# Altium schematic sheet ATmega328 V1.0.SchDoc
size 228 x 88 mm
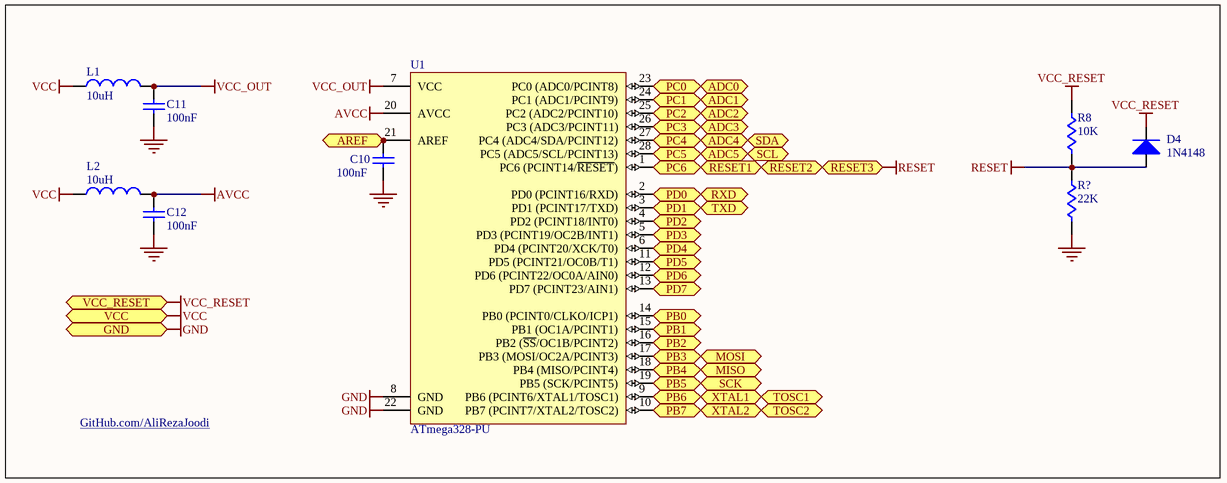
[diagram p0: ATmega328 V1.0.SchDoc]

## Parts
C10  100nF  [CAPNTO2.54-3.56x2.03]
C11  100nF  [CAPNTO2.54-3.56x2.03]
C12  100nF  [CAPNTO5.08-7.37x3.94]
D4  1N4148  [DIODE0.4_Glass]
L1  10uH  [Inductor_1]
L2  10uH  [Inductor_1]
R8  10K  [AXIAL-0.4]
R?  22K  [AXIAL-0.4]
U1  ATmega328-PU  [28P3]

## Ports
ADC0, ADC1, ADC2, ADC3, ADC4, ADC5, AREF, GND, MISO, MOSI, PB0, PB1, PB2, PB3, PB4, PB5, PB6, PB7, PC0, PC1, PC2, PC3, PC4, PC5, PC6, PD0, PD1, PD2, PD3, PD4, PD5, PD6, PD7, RESET1, RESET2, RESET3, RXD, SCK, SCL, SDA, TOSC1, TOSC2, TXD, VCC, VCC_RESET, XTAL1, XTAL2

## Nets
AVCC: C12.2 L2.2 U1.20(AVCC)
GND: C10.1 C11.1 C12.1 R?.1 U1.8(GND) U1.22(GND) ; port GND
RESET: D4.1(A) R8.1 R?.2 U1.1(PC6_(PCINT14/~{RESET})) ; port RESET1, port PC6, port RESET2, port RESET3
VCC: L1.2 L2.1 ; port VCC
VCC_OUT: C11.2 L1.1 U1.7(VCC)
VCC_RESET: D4.2(K) R8.2 ; port VCC_RESET
ADC0: U1.23(PC0_(ADC0/PCINT8)) ; port ADC0, port PC0
ADC1: U1.24(PC1_(ADC1/PCINT9)) ; port PC1, port ADC1
ADC2: U1.25(PC2_(ADC2/PCINT10)) ; port PC2, port ADC2
ADC3: U1.26(PC3_(ADC3/PCINT11)) ; port PC3, port ADC3
ADC4: U1.27(PC4_(ADC4/SDA/PCINT12)) ; port SDA, port PC4, port ADC4
ADC5: U1.28(PC5_(ADC5/SCL/PCINT13)) ; port SCL, port PC5, port ADC5
AREF: C10.2 U1.21(AREF) ; port AREF
MISO: U1.18(PB4_(MISO/PCINT4)) ; port PB4, port MISO
MOSI: U1.17(PB3_(MOSI/OC2A/PCINT3)) ; port PB3, port MOSI
PB0: U1.14(PB0_(PCINT0/CLKO/ICP1)) ; port PB0
PB1: U1.15(PB1_(OC1A/PCINT1)) ; port PB1
PB2: U1.16(PB2_(~{SS}/OC1B/PCINT2)) ; port PB2
PB5: U1.19(PB5_(SCK/PCINT5)) ; port PB5, port SCK
PB6: U1.9(PB6_(PCINT6/XTAL1/TOSC1)) ; port PB6, port XTAL1, port TOSC1
PB7: U1.10(PB7_(PCINT7/XTAL2/TOSC2)) ; port PB7, port XTAL2, port TOSC2
PD0: U1.2(PD0_(PCINT16/RXD)) ; port PD0, port RXD
PD1: U1.3(PD1_(PCINT17/TXD)) ; port PD1, port TXD
PD2: U1.4(PD2_(PCINT18/INT0)) ; port PD2
PD3: U1.5(PD3_(PCINT19/OC2B/INT1)) ; port PD3
PD4: U1.6(PD4_(PCINT20/XCK/T0)) ; port PD4
PD5: U1.11(PD5_(PCINT21/OC0B/T1)) ; port PD5
PD6: U1.12(PD6_(PCINT22/OC0A/AIN0)) ; port PD6
PD7: U1.13(PD7_(PCINT23/AIN1)) ; port PD7

## Notes on the sheet
- GitHub.com/AliRezaJoodi

## Library data of the parts
C10-C12 = Cap: Capacitor; Manufacturer: Generic Components; Class I: Passive; Published: 8-Jun-2000; Revision: July-2002: Re-released for DXP Platform.; Publisher: Altium Limited; Class II: Capacitor
D4 = Diode: Default Diode; Manufacturer: Generic Components; Class I: Discrete; Class II: Diode - Switching; Published: 8-Jun-2000; Revision: July-2002: Re-released for DXP Platform.; Publisher: Altium Limited
L1 L2 = Inductor: Manufacturer: Generic Components; Class I: Passive; Published: 8-Jun-2000; Revision: July-2002: Re-released for DXP Platform.; Publisher: Altium Limited; Class II: Inductor; Supplier 1: Newark
R8 R? = Res1: Resistor; Manufacturer: Generic Components; Class I: Passive; Published: 8-Jun-2000; Revision: July-2002: Re-released for DXP Platform.; Publisher: Altium Limited; Class II: Resistor
U1 = ATmega328-PU: 8-bit AVR Microcontroller, 32KB Flash, 1KB EEPROM, 2KB SRAM, 28-pin PDIP, Industrial Grade (-40°C to 85°C); Published: 1-Apr-2010; DatasheetVersion: revA, Jan-2010; PackageVersion: revB, Sep-2001; PackageReference: 28P3; Publisher: Altium Limited; PackageDescription: 28-lead (0.300"/7.62mm Wide) Plastic Dual Inline Package (PDIP); Supplier 1: Digi-Key; Supplier Part Number 1: ATMEGA328-PU-ND; Supplier 2: Mouser; Supplier Part Number 2: 556-ATMEGA328-PU; ComponentLink1Description: Manufacturer Link; ComponentLink1URL: http://www.atmel.com/products/avr/default.asp?; ComponentLink2Description: ATmega48A/48PA/88A/88PA/168A/168PA/328/328P Datasheet; ComponentLink2URL: http://www.atmel.com/dyn/resources/prod_documents/8271.pdf; ComponentLink3Description: ATmega48A/48PA/88A/88PA/168A/168PA/328/328P Summary; ComponentLink3URL: http://www.atmel.com/dyn/resources/prod_documents/8271S.pdf; ComponentLink4Description: Atmel.com Home; ComponentLink4URL: http://www.atmel.com